# Altium project AC to DC(12V).PrjPcb
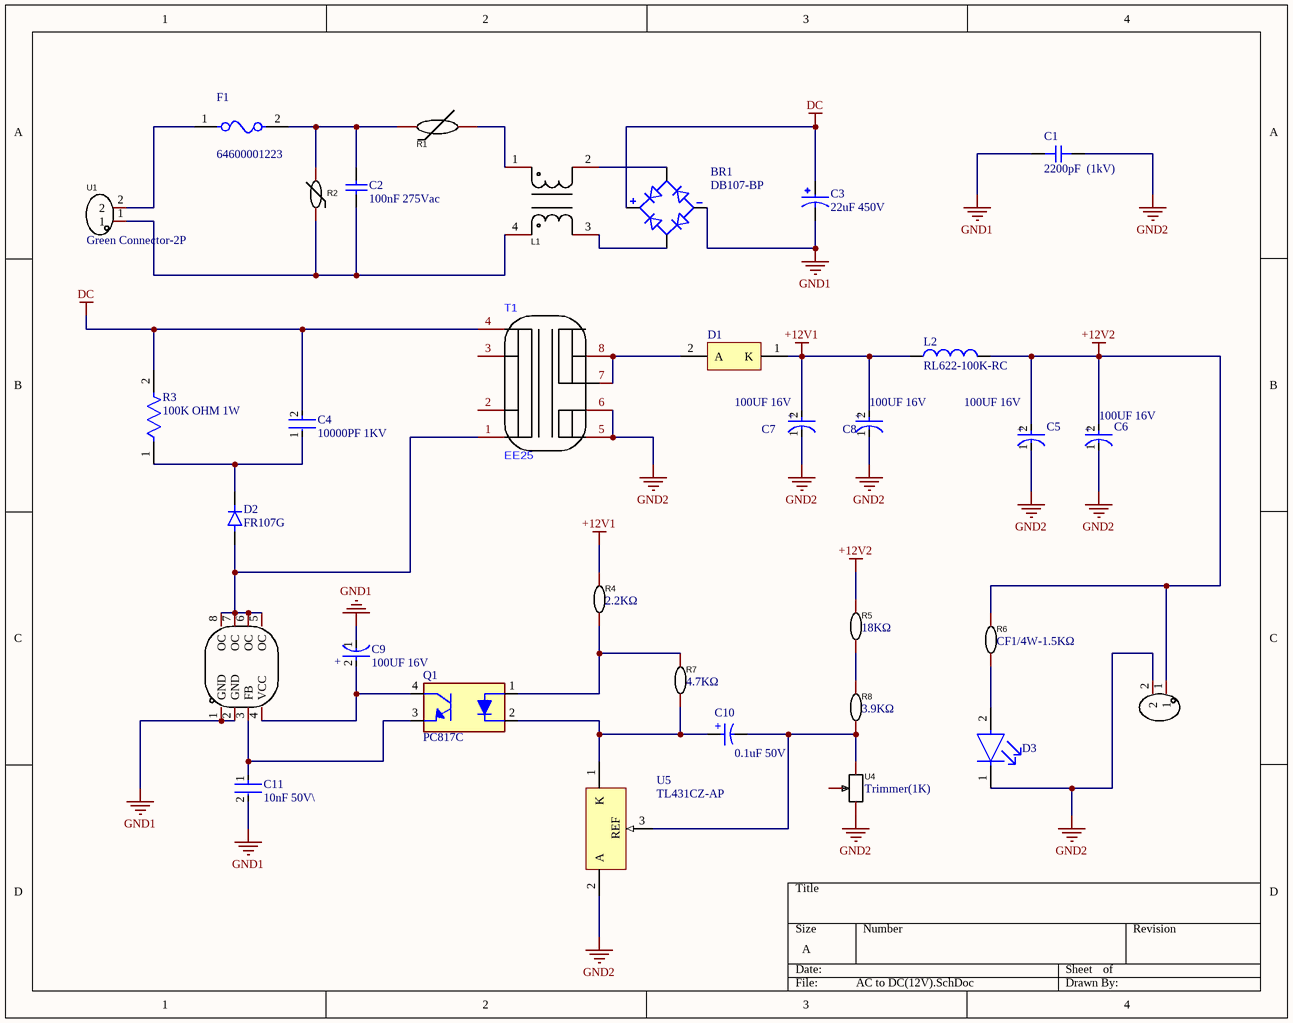
[diagram p0: AC to DC(12V).SchDoc]
1 sheet, 33 parts. Net scope: global (net labels, ports and power ports of the same name join across sheets).

## Sheet AC to DC(12V).SchDoc
size A; SheetNumber: 1; SheetTotal: 1

### Parts
BR1  DB107-BP  [DIP825W50P509L880H320Q4]
C1  2200pF  (1kV)  [CAPC3216X94N]
C2  100nF 275Vac  [WCAP-FTX2_L18W6H12_CS]
C3  22uF 450V  [CAPPRD750W80D1600H2500]
C4  10000PF 1KV  [FP-562R5GAS10-MFG]
C5  100UF 16V  [FP-OS-CON-TH-C9-d_0_6-MFG]
C6  100UF 16V  [FP-OS-CON-TH-C9-d_0_6-MFG]
C7  100UF 16V  [FP-OS-CON-TH-C9-d_0_6-MFG]
C8  100UF 16V  [FP-OS-CON-TH-C9-d_0_6-MFG]
C9  100UF 16V  [FP-OS-CON-TH-C9-d_0_6-MFG]
C10  0.1uF 50V  [WCAP-ATG8_D5H11]
C11  10nF 50V\  [FP-RCE1K1-2_5-MFG]
D1  MBR160RLG  [ONSC-AXIAL_LEAD-2-59-10_P]  (value not drawn)
D2  FR107G  [DIOAD1036W78L470D235]
D3  XQERED-H2-0000-000000301  [FP-XQE-MFG]  (value not drawn)
F1  64600001223  [FP-64600001223-MFG]
L1  UU9.8-10mH  [CMC 10mH]  (value not drawn)
L2  RL622-100K-RC  [INDR62-500-1100X850X1100]
Q1  PC817C  [DIP762W50P254L650H458Q4B]
R1  MF72 10D7_C72680  [NTC thermistor]  (value not drawn)
R2  10D561K_C233178  [varistor]  (value not drawn)
R3  100K OHM 1W  [FP-RR01-MFG]
R4  2.2KΩ  [CF1/4W-2.2K]
R5  18KΩ  [CF1/4W-2.2K]
R6  CF1/4W-1.5KΩ  [CF1/4W-2.2K]
R7  4.7KΩ  [CF1/4W-2.2K]
R8  3.9KΩ  [CF1/4W-2.2K]
T1  EE25  [EE25]
U1  Green Connector-2P  [KF127-5.0-2P]
U2  DK124  [AC-DC controller]  (value not drawn)
U3  XH-2PA  [XH-2PA white connector]  (value not drawn)
U4  Trimmer(1K)  [trimmer 1K]
U5  TL431CZ-AP  [TO-92]

### Nets
+12V1: C7.2(A) C8.2(A) D1.1(K) L2.1 R4.2
+12V2: C5.2(A) C6.2(A) L2.2 R5.2 R6.2 U3.1
DC: BR1.1(POS) C3.P C4.2 R3.2 T1.4
GND1: BR1.2(NEG) C1.1(A) C3.N C9.1(C) C11.2 U2.1(GND) U2.2(GND)
GND2: C1.2(B) C5.1(C) C6.1(C) C7.1(C) C8.1(C) D3.1(C) T1.5 T1.6 U3.2 U4.1 U5.2(A)
NetBR1_3: BR1.3(AC1) L1.2
NetBR1_4: BR1.4(AC2) L1.3
NetC2_1: C2.1 F1.2 R1.1 R2.2
NetC2_2: C2.2 L1.4 R2.1 U1.1
NetC4_1: C4.1 D2.C(K) R3.1
NetC9_2: C9.2(A) Q1.4 U2.4(VCC)
NetC10_1: C10.1(P) Q1.2 R7.1 U5.1(K)
NetC10_2: C10.2(N) R8.1 U4.3 U5.3(REF)
NetC11_1: C11.1 Q1.3 U2.3(FB)
NetD1_2: D1.2(A) T1.7 T1.8
NetD2_A: D2.A T1.1 U2.5(OC) U2.6(OC) U2.7(OC) U2.8(OC)
NetD3_2: D3.2(A) R6.1
NetF1_1: F1.1 U1.2
NetL1_1: L1.1 R1.2
NetQ1_1: Q1.1 R4.1 R7.2
NetR5_1: R5.1 R8.2

Not connected (* = marked no-connect by the designer): T1 2 3; U4 2

### Notes on the sheet
- (in symbol CMP-03913-54007254-1) +
- (in symbol CMP-05428-000281-1) +

### Library data of the parts
BR1 = DB107-BP: MF: {'manufacturer': u'Micro Commercial Components'}; Package: None; Price: None; Value: *; MP: DB107-BP; Availability: Unavailable
C1 = 1206AC222KAT1A: 2200pF Â±10% 1000V (1kV) Ceramic Capacitor X7R 1206 (3216 Metric); MF: {'manufacturer': u'AVX'}; Package: None; Price: None; Value: *; MP: 1206AC222KAT1A; Availability: Unavailable
C2 = CMP-03913-51400111-2: 890324025017CS WCAP-FTX2 Film Capacitor 100nF 275Vac; Pin Length: 4mm; Insulation Resistance: 30GΩ; Hole Diameter: 1.1mm; Voltage Rating (DC): 275V; Tolerance: 10%; Dielectric Material: PP; Pitch: 15mm; Mount: Through Hole; Lead Pitch: 15.0114mm; Case/Package: Radial; Packaging: Carton; Height: 12mm; Max Operating Temperature: 105°C; Voltage Rating (AC): 275V; REACH SVHC: Unknown; Length: 18mm; Termination: PC Pins; Height - Seated (Max): 12.4968mm; Voltage Rating: 275V; NexarPartId: 51400111; Dielectric: PP; Capacitance: 100nF; RoHS: Compliant; Min Operating Temperature: -40°C; Width: 6mm
C3 = ECA2WHG220: Cap Aluminum 22uF 450V 20% (16 X 25mm) Radial Aluminum Cylindrical Can 7.5mm 115mA 2000 hr 105C Bulk; MF: Panasonic; MP: ECA-2WHG220; Package: RADIAL-2 Panasonic; Value: *; Availability: In Stock; Check_prices: https://www.snapeda.com/parts/ECA-2WHG220/Panasonic/view-part/390097/?ref=eda; Price: None; SnapEDA_Link: https://www.snapeda.com/parts/ECA-2WHG220/Panasonic/view-part/390097/?ref=snap
C4 = CMP-02417-000061-1: CAP CER 10000PF 1KV Z5U RADIAL; Dissipation Factor: 2.5%; Tolerance: 20%; Lead Length: 29mm; Lead Diameter: 0.64mm; Lead/Base Style: Straight; Application(s): GENERAL PURPOSE; Capacitance: 10nF; Voltage Rating: 1kV; Voltage Rating (DC): 1kV; Depth: 4mm; Package Quantity: 250; Case/Package: Radial; Radiation Hardening: No; Diameter: 12.4mm; Dielectric: Z5U; Series: Cera-Mite 562R; Height: 0.25inch; Length: 2inch; Resistor Type: Ceramic; Width: 4mm; Contact Plating: Tin; Height - Seated (Max): 0.613inch; Packaging: Bulk; Lead Free: Lead Free; Construction: RADIAL; Mount: Through Hole; RoHS Compliant: Yes; Termination: Radial; Min Operating Temperature: -55°C; Lead Pitch: 9.5mm; Weight: 0.01lb; Max Operating Temperature: 105°C; Voltage: 1kV
C5-C9 = CMP-05428-000281-1: CAP ALUM POLY 100UF 20% 16V T/H; Dissipation Factor: 10%; Life (Hours): 2000Hour; Lead Diameter: 0.6mm; Polarity: Polar; ESR (Equivalent Series Resistance): 10mR; Ripple Current: 4.68A; Leakage Current: 500uA; Lead Free: Lead Free; Package Quantity: 500; Termination: Radial; Max Operating Temperature: 105°C; Tolerance: 20%; Mount: Through Hole; Radiation Hardening: No; Height - Seated (Max): 0.354inch; Diameter: 6.3mm; Series: OS-CON, SEPC; Height: 9mm; REACH SVHC: No SVHC; Voltage Rating: 16V; Case/Package: Radial; Packaging: Bulk; RoHS Compliant: Yes; Capacitance: 100uF; Lead Pitch: 2.5mm; Length: 9mm; Voltage Rating (DC): 16V; Min Operating Temperature: -55°C
C10 = CMP-03913-54007254-1: 860010672001 Cap Aluminum Lytic 0.1uF 50V 20% (5 X 11mm) Radial 2mm 3.3mA 2000h 85C; Capacitance: 100nF; Polarity: Polar; Material: Aluminium; Life (Hours): 2000hours; Leakage Current: 3µA; Lead Pitch: 2.0066mm; Mount: Through Hole; Diameter: 5mm; RoHS: Compliant; Max Operating Temperature: 85°C; Case/Package: Radial; Packaging: Tape & Box (TB); REACH SVHC: Unknown; Pitch: 2mm; Ripple Current: 3.3mA; Tolerance: 20%; NexarPartId: 54007254; Voltage Rating (DC): 50V; Height: 11mm; Min Operating Temperature: -40°C; Height - Seated (Max): 12.4968mm; Length: 11mm; Voltage Rating: 50V
C11 = CMP-06035-061841-1: Cap Ceramic Monolithic 10nF 50V 5% Thru-Hole Bulk; Lead/Base Style: Formed Leads; Lead Diameter: 0.5mm; Dielectric: C0G; Height - Seated (Max): 0.138inch; Termination: Radial; Ratings: AEC-Q200; Width: 0.098inch; RoHS Compliant: Yes; Package Quantity: 2000; Voltage: 50V; Packaging: Tape and Reel; Voltage Rating (DC): 50V; Depth: 2.5mm; Tolerance: 5%; Voltage Rating: 50V; Length: 4mm; Capacitance: 10nF; Height: 3.5mm; Min Operating Temperature: -55°C; Max Operating Temperature: 125°C; Case/Package: Radial; Mount: Through Hole; Resistor Type: Ceramic; Lead Pitch: 0.197inch
D1 = CMP-1055-00054-1: Rectifier, 2-Pin Axial_Lead, Pb-Free, Tape and Reel; Manufacturer: On Semiconductor; IFSM Max (A): 25; Configuration: Single; PackageVersion: Rev. U, 02/2005; ComponentLink3Description: Package Specification; Mounting Technology: Through Hole; Packing: Tape and Reel; PackageReference: AXIAL_LEAD-2-59-10; ComponentLink3URL: http://www.onsemi.cn/pub_link/Collateral/59-10.PDF; PackageDescription: 2-Pin, Axial Lead, Diameter 2.35 mm; PartNumber: MBR160RLG; ComponentLink1URL: http://www.onsemi.com/; RoHS: TRUE; DatasheetVersion: Rev. 8; ComponentLink1Description: Manufacturer URL; ComponentLink2Description: Datasheet; ComponentLink2URL: http://www.onsemi.cn/pub_link/Collateral/MBR150-D.PDF
D2 = FR107G: MF: {'manufacturer': u'Taiwan Semiconductor'}; Package: None; Price: None; Value: *; MP: FR107G; Availability: Unavailable
D3 = CMP-13977-000012-1: LED XLAMP RED 620NM 1616 SMD; Manufacturer: Cree Inc.; Forward Voltage: 2.2V; Reverse Voltage: 5V; Forward Current: 350mA; Luminous Flux: 45.7lm; Led Orientation: Top View; Wavelength: 630nm; Max Junction Temp: +150°C; Viewing Angle: 125°; Digikey Description: LED XLAMP RED 620NM 1616 SMD; Lead Free: Yes; Temperature Range High: +150°C; Manufacturer Part Number: XQERED-H2-0000-000000301; RoHS: TRUE; Device Class L2: LEDs; Device Class L1: Optoelectronics; ComponentLink2URL: https://www.cree.com/led-components/media/documents/ds-XQE.pdf; Octopart: https://octopart.com/xqered-h2-0000-000000301-cree-65034092; Category: Diode; Temperature: to +150°C; Height: 0.9mm; Colour: Red; Package: XQE; Device Class L3: unset; Automotive: No; Mouser Description: High Power LEDs - Single Color Red 45.7lm; ComponentLink2Description: Datasheet
F1 = CMP-08604-000020-1: FUSE BLOCK CART 250V 6.3A PCB; Manufacturer: Littelfuse Inc; Number Of Fuses: 1; Conn Orientation: Horizontal; ComponentLink2URL: https://www.littelfuse.com/~/media/electronics/datasheets/fuse_blocks/littelfuse_fuse_block_646_datasheet.pdf.pdf; Manufacturer Part Number: 64600001223; Mouser Description: Fuse Holder Screw Mount Bulk; Voltage Rating Ac: 250V; Voltage Rating Dc: 250V; Category: Fuse; Fuse Current: 6.3A; Octopart: https://octopart.com/64600001223-littelfuse-39645661; Package: 0; Automotive: No; Height: 12mm; Device Class L3: unset; ComponentLink2Description: Datasheet; Digikey Description: FUSE BLOCK CART 250V 6.3A PCB; Device Class L1: Circuit Protection; Lead Free: Yes; Device Class L2: Fuse Holders; RoHS: TRUE
L1 = UU9.8-10mH: Manufacturer: FH(风华); Add into BOM: yes; Number of Lines: 2; Withstanding Voltage: 1kV; Inductance @ Frequency: 10mH@1kHz; DC Resistance (DCR): 800mΩ; Symbol: UU9.8-10MH; Device: UU9.8-10mH; LCSC Part Name: 两路 插件共模滤波器; Supplier Part: C148474; Manufacturer Part: UU9.8-10mH; Supplier Footprint: 插件; JLCPCB Part Class: Extended Part; Datasheet: https://atta.szlcsc.com/upload/public/pdf/source/20210713/C148474_656501625637B4BA0D3972AB204D3908.pdf; Supplier: LCSC; Convert to PCB: yes; Current Rating: -; Voltage Rating - DC: -; Voltage Rating: -; Impedance @ Frequency: -; Operating Temperature: -
L2 = CMP-1747-00016-1: Radial Inductor, 10 uH, +/- 10%, 3 A, -55 to 105 degC, 2-Pin THD, RoHS, Bulk; Outputs: 4; Case\Package: DIP; Output Voltage: 36 V; Interface: Parallel; Min Supply Voltage: 4.5 V; Output Current: 600 mA; Max Operating Temperature: 70 degC; PackageDescription: 2-Pin Radial Lead, Dia 8.5 mm, Pitch 5 mm; Min Operating Temperature: 0 degC; ComponentLink2Description: Datasheet; Mount: Through Hole; PackageReference: INDR62-500-1100X850X1100; REACH SVHC: No SVHC; Width: 0.25 inch; Package Quantity: 25; ComponentLink1Description: Manufacturer URL; Height: 0.25 inch; DatasheetVersion: Aug-10; Packaging: Rail/Tube; Length: 0.75 inch; Max Supply Voltage: 36 V; RoHSCompliant: true; ComponentLink1URL: http://www.bourns.com/; Radiation Hardening: No; Weight: 0.03357 oz; Pins: 16; ComponentLink2URL: http://www.bourns.com/docs/Product-Datasheets/rl622_series.pdf
Q1 = PC817C: High Density Mounting Type Photocoupler; MF: {'manufacturer': u'Sharp Corporation'}; Package: None; Price: None; Value: *; MP: PC817C; Availability: Unavailable
R1 = MF72 10D7_C72680: Manufacturer: 时恒; Symbol: MF72-10D7; Value: Power; Add into BOM: yes; Steady State Current (Max): 1A; Device: MF72 10D7_C72680; Supplier: LCSC; Manufacturer Part: MF72 10D7; Supplier Part: C72680; JLCPCB Part Class: Extended Part; LCSC Part Name: 10Ω 电阻精度:±20% 2800K; Supplier Footprint: 插件,P=5mm; Datasheet: https://atta.szlcsc.com/upload/public/pdf/source/20231113/55BE817FC059D652AE7104DE5FB0A908.pdf; Convert to PCB: yes; B Constant (25℃/75℃): -; B Constant (25℃/85℃): -; B Constant (25℃/100℃): -; Operating Temperature: -40℃~+130℃
R2 = 10D561K_C233178: Manufacturer: RUILON(瑞隆源); Value: Shenzhen; Add into BOM: yes; Varistor Voltage: 504V~616V; Maximum Energy: 42.3J; Typical Capatitance: 180pF@1kHz; Symbol: 10D561K_C233178; Device: 10D561K_C233178; Supplier: LCSC; Supplier Part: C233178; Manufacturer Part: 10D561K; JLCPCB Part Class: Extended Part; LCSC Part Name: 钳位电压920V 42.3焦耳 插件压敏电阻; Supplier Footprint: 插件; Datasheet: https://atta.szlcsc.com/upload/public/pdf/source/20180619/C233186_9A7AF57C0A178A4DEED9AC3F9621CA64.pdf; Convert to PCB: yes
R3 = CMP-03212-000008-1: RES 100K OHM 5% 1W AXIAL; Number of Resistors: 1; Temperature Coefficient: 300ppm/°C; Voltage Rating: 350V; Resistance: 100kR; Package Quantity: 5000; Power Rating: 1W; Packaging: Ammo Pack; Min Operating Temperature: -55°C; Number of Terminations: 2; Resistor Type: Power resistor; Length: 6.8mm; ELV: Compliant; Mount: Axial; RoHS Compliant: Yes; Case/Package: Metal; Diameter: 2.6mm; Termination: Axial; Series: RR; Max Operating Temperature: 155°C; Tolerance: 5%
R4 = CF1/4W-2.2KΩ±5% T: Manufacturer: CCO(千志电子); Symbol: CF1/4W-2.2KΩ±5% T52; Add into BOM: yes; Tolerance: ±5%; Overload Voltage (Max): 250V; Power(Watts): 250mW; Temperature Coefficient: ±350ppm/℃; Device: CF1/4W-2.2KΩ±5% T; LCSC Part Name: 2.2kΩ ±5% 250mW 碳膜电阻; Supplier Part: C120063; Manufacturer Part: CF1/4W-2.2KΩ±5% T; Supplier Footprint: 插件,D2.3xL6.5mm; JLCPCB Part Class: Extended Part; Datasheet: https://atta.szlcsc.com/upload/public/pdf/source/20190910/C427328_A0A2D65F3FD547937F4E674C90868175.pdf; Supplier: LCSC; Convert to PCB: yes; Type: Carbon Resister; Value: 2.2kΩ; Operating Temperature Range: -55℃~+155℃
R5-R8 = CF1/4W-2.2KΩ±5% T: Manufacturer: CCO(千志电子); Symbol: CF1/4W-2.2KΩ±5% T52; Add into BOM: yes; Value: 2.2kΩ; Tolerance: ±5%; Overload Voltage (Max): 250V; Power(Watts): 250mW; Temperature Coefficient: ±350ppm/℃; Device: CF1/4W-2.2KΩ±5% T; LCSC Part Name: 2.2kΩ ±5% 250mW 碳膜电阻; Supplier Part: C120063; Manufacturer Part: CF1/4W-2.2KΩ±5% T; Supplier Footprint: 插件,D2.3xL6.5mm; JLCPCB Part Class: Extended Part; Datasheet: https://atta.szlcsc.com/upload/public/pdf/source/20190910/C427328_A0A2D65F3FD547937F4E674C90868175.pdf; Supplier: LCSC; Convert to PCB: yes; Type: Carbon Resister; Operating Temperature Range: -55℃~+155℃
U1 = KF127-5.0-2P: Manufacturer: KEFA(科发); Add into BOM: yes; Structure: 1x2P; Pitch: 5mm; Current Rating (Max): 15A; Voltage Rating (Max): 250V; Wire Gauge - AWG: 14~26; Wire Gauge - mm2: 1.5; Number of PINs Per Row: 2; Symbol: KF127-5.0-2P; Device: KF127-5.0-2P; Supplier: LCSC; Supplier Part: C474904; Manufacturer Part: KF127-5.0-2P; JLCPCB Part Class: Extended Part; LCSC Part Name: 5mm 1x2P 排数:1 每排P数:2 直插; Supplier Footprint: 插件,P=5mm; Datasheet: https://atta.szlcsc.com/upload/public/pdf/source/20230317/A76A1969A1719ACA3DDCF692059F3CA5.pdf; Convert to PCB: yes; Color: Green; Mounting Style: Straight; Number of Pins: 2P; Number of Rows: 1; Operating Temperature Range: -40℃~+105℃
U2 = DK124: Manufacturer: DK(东科半导体); Add into BOM: yes; Symbol: DK124; Device: DK124; LCSC Part Name: DK124; Supplier Part: C78752; Manufacturer Part: DK124; Supplier Footprint: DIP-8; JLCPCB Part Class: Extended Part; Datasheet: https://atta.szlcsc.com/upload/public/pdf/source/20170523/1495534039933.pdf; Supplier: LCSC; Convert to PCB: yes
U3 = XH-2PA: Manufacturer: ZHOURI(洲日); Add into BOM: yes; Symbol: XH-2PA; Device: XH-2PA; LCSC Part Name: XH-2PA; Supplier Part: C5258883; Manufacturer Part: XH-2PA; Supplier Footprint: 插件,P=2.5mm; JLCPCB Part Class: Extended Part; Datasheet: https://atta.szlcsc.com/upload/public/pdf/source/20221111/941C48A64A881023E1ECD9BB647261A0.pdf; Supplier: LCSC; Convert to PCB: yes
U4 = WH06-2C-102(1K): Manufacturer: BOCHEN(博晨); Add into BOM: yes; Value: 1kΩ; Tolerance: ±25%; Symbol: WH06-2C-102(1K); Device: WH06-2C-102(1K); LCSC Part Name: 1kΩ ±25%; Supplier Part: C5205040; Manufacturer Part: WH06-2C-102(1K); Supplier Footprint: 插件; JLCPCB Part Class: Extended Part; Datasheet: https://atta.szlcsc.com/upload/public/pdf/source/20221019/683A1EE763180882FA5E0C1228474CEE.pdf; Supplier: LCSC; Convert to PCB: yes
U5 = CMP-0242-00003-1: Programmable Voltage Reference, 2.5 to 36V, 3-Pin TO-92, Ammopak; ComponentLink2URL: http://www.st.com/internet/com/TECHNICAL_RESOURCES/TECHNICAL_LITERATURE/DATASHEET/CD00000986.pdf; PackageReference: TO-92; ComponentLink1Description: Manufacturer URL; ComponentLink1URL: http://www.st.com; ComponentLink2Description: Datasheet; PackageVersion: 2011; DatasheetVersion: Oct-2011; PackageDescription: TO, Flat Index; 3 In-Line, Axial Leads; Body Dia. 4.7mm; Lead Dia. 0.56 mm (max)